# EAGLE schematic KnightOfTone (EAGLE 9.5.2)
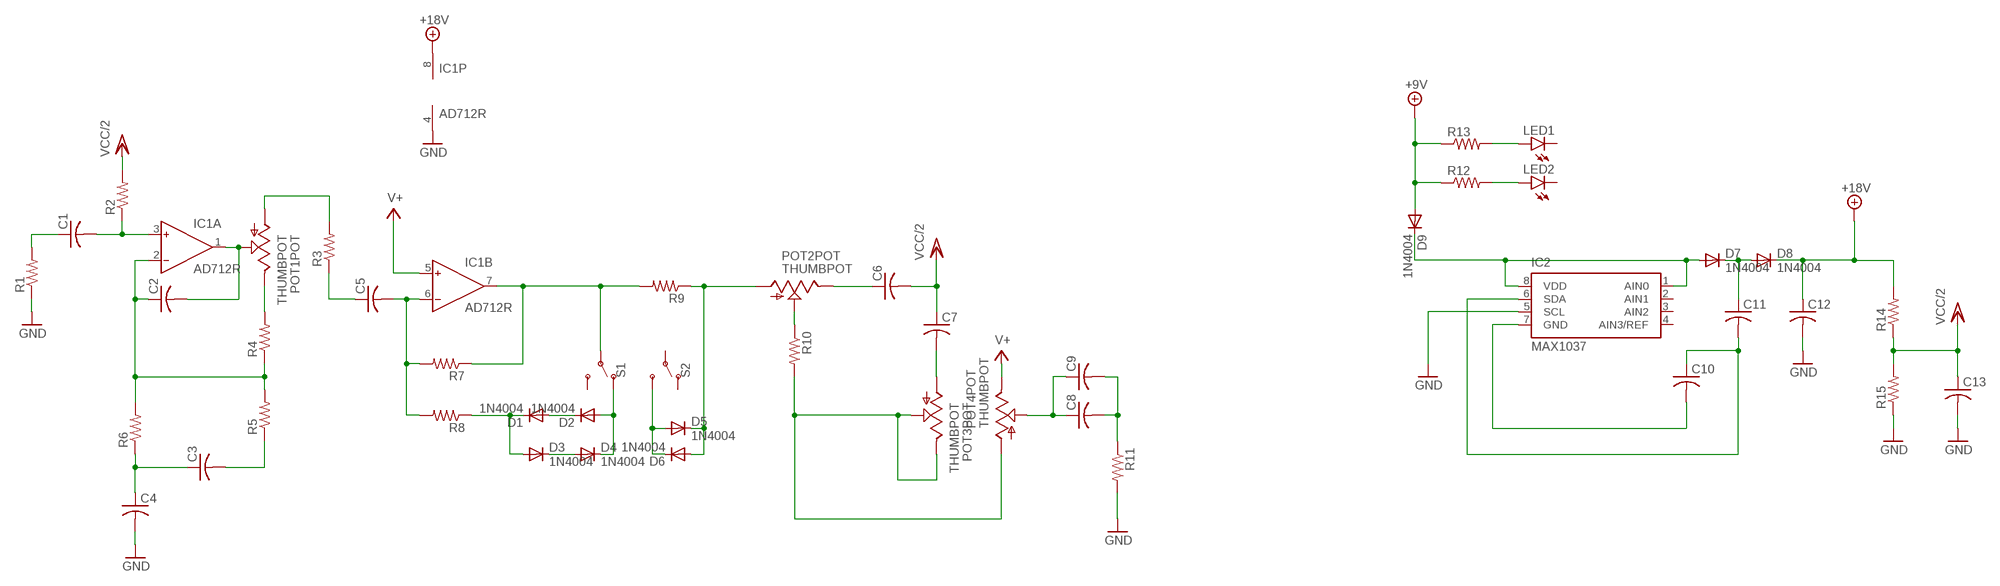
[diagram p0: schematic, sheet 1]

## Parts
C1  C-USC0603  [C0603]
C2  C-USC0603  [C0603]
C3  C-USC0603  [C0603]
C4  C-USC0603  [C0603]
C5  C-USC0603  [C0603]
C6  C-USC0603  [C0603]
C7  C-USC0603  [C0603]
C8  C-USC0603  [C0603]
C9  C-USC0603  [C0603]
C10  C-USC0603  [C0603]
C11  C-USC0603  [C0603]
C12  C-USC0603  [C0603]
C13  C-USC0603  [C0603]
D1  1N4004  [DO41-10]
D2  1N4004  [DO41-10]
D3  1N4004  [DO41-10]
D4  1N4004  [DO41-10]
D5  1N4004  [DO41-10]
D6  1N4004  [DO41-10]
D7  1N4004  [DO41-10]
D8  1N4004  [DO41-10]
D9  1N4004  [DO41-10]
IC1  AD712R  [SO8]
IC2  MAX1037  [SOT23-8L]
LED1  LED3MM  [LED3MM]
LED2  LED3MM  [LED3MM]
POT1  THUMBPOT  [THUMBWHEEL]
POT2  THUMBPOT  [THUMBWHEEL]
POT3  THUMBPOT  [THUMBWHEEL]
POT4  THUMBPOT  [THUMBWHEEL]
R1  R-US_R0603  [R0603]
R2  R-US_R0603  [R0603]
R3  R-US_R0603  [R0603]
R4  R-US_R0603  [R0603]
R5  R-US_R0603  [R0603]
R6  R-US_R0603  [R0603]
R7  R-US_R0603  [R0603]
R8  R-US_R0603  [R0603]
R9  R-US_R0603  [R0603]
R10  R-US_R0603  [R0603]
R11  R-US_R0603  [R0603]
R12  R-US_R0603  [R0603]
R13  R-US_R0603  [R0603]
R14  R-US_R0603  [R0603]
R15  R-US_R0603  [R0603]
S1  SWITCH-SPDT-PTH-11.6X4.0MM  [SWITCH_SPDT_PTH_11.6X4.0MM]
S2  SWITCH-SPDT-PTH-11.6X4.0MM  [SWITCH_SPDT_PTH_11.6X4.0MM]

## Nets
+9V: D9.A R12.1 R13.1
+18V: C12.1 D8.C IC1.8(P:V+) R14.2
GND: C4.2 C12.2 C13.2 IC1.4(P:V-) IC2.5(SCL) R1.1 R11.2 R15.1
N$1: C1.2 IC1.3(A:IN+) R2.1
N$2: C1.1 R1.2
N$3: POT1.3(POT:E) R4.2
N$4: C3.2 R5.1
N$5: C2.1 IC1.2(A:IN-) R4.1 R5.2 R6.2
N$6: C2.2 IC1.1(A:OUT) POT1.2(POT:S)
N$7: C3.1 C4.1 R6.1
N$8: POT1.1(POT:A) R3.2
N$9: C5.1 R3.1
N$10: C5.2 IC1.6(B:IN-) R7.2 R8.2
N$12: IC1.7(B:OUT) R7.1 R9.2 S1.2(P)
N$13: D1.C D3.A R8.1
N$14: D1.A D2.C
N$15: D3.C D4.A
N$16: D2.A D4.C S1.1(O)
N$17: D5.A D6.C S2.3(S)
N$18: D5.C D6.A POT2.1(POT:A) R9.1
N$19: POT2.2(POT:S) R10.1
N$20: C6.1 POT2.3(POT:E)
N$21: POT3.2(POT:S) POT3.3(POT:E) POT4.1(POT:A) R10.2
N$22: C7.2 POT3.1(POT:A)
N$24: D7.A D9.C IC2.1(AIN0) IC2.8(VDD)
N$25: C8.1 C9.1 POT4.2(POT:S)
N$26: C8.2 C9.2 R11.1
N$28: C10.2 IC2.7(GND)
N$29: C10.1 C11.2 IC2.6(SDA)
N$30: C11.1 D7.C D8.A
N$33: LED1.A R13.2
N$34: LED2.A R12.2
V+: IC1.5(B:IN+) POT4.3(POT:E)
VCC/2: C6.2 C7.1 C13.1 R2.2 R14.1 R15.2
Unconnected: IC2.2(AIN1) IC2.3(AIN2) IC2.4(AIN3/REF) LED1.K(C) LED2.K(C) POT1.SW1(SW:S) POT1.SW2(SW:P) POT2.SW1(SW:S) POT2.SW2(SW:P) POT3.SW1(SW:S) POT3.SW2(SW:P) POT4.SW1(SW:S) POT4.SW2(SW:P) S1.3(S) S2.1(O) S2.2(P)

## Library data of the parts
C1-C13 = rcl:C-US: CAPACITOR, American symbol; SPICEPREFIX: C
D1-D9 = adafruit:1N4004: DIODE General purpose 1N400x type rectifier (With bigger pads) http://www.ladyada.net/library/pcb/eaglelibrary.html
IC1 = analog-devices:AD712: Dual Precision, Low Cost, High Speed BiFET Op Amp Source: http://www.analog.com/static/imported-files/data_sheets/AD712.pdf; MF: ALTERA CORPORATION; MPN: AD712KRZ; OC_FARNELL: 1263975; OC_NEWARK: 59K4556
IC2 = maxim:MAX103*: 2.7V to 5.5V, Low-Power, 4-/12-Channel 2-Wire Serial 8-Bit ADCs Source: http://datasheets.maxim-ic.com/en/ds/MAX1036-MAX1039M.pdf; MF: MAXIM; MPN: MAX1037EKA+T; OC_FARNELL: unknown; OC_NEWARK: 68K9410
LED1 LED2 = led:LED: LED OSRAM: - CHIPLED LG R971, LG N971, LY N971, LG Q971, LY Q971, LO R971, LY R971 LH N974, LH R974 LS Q976, LO Q976, LY Q976 LO Q996 - Hyper CHIPLED LW Q18S LB Q993, LB Q99A, LB R99A - SideLED LS A670, LO A670, LY A670, LG A670, LP A670 LB A673, LV A673, LT A673, LW A673 LH A674 LY A675 LS A676, LA A676, LO A676, LY A676, LW A676 LS A679, LY A679, LG A679 - Hyper Micro SIDELED® LS Y876, LA Y876, LO Y876, LY Y876 LT Y87S - SmartLED LW L88C, LW L88S LB L89C, LB L89S, LG L890 LS L89K, LO L89K, LY L89K LS L896, LA L896, LO L896, LY L896 - TOPLED LS T670, LO T670, LY T670, LG T670, LP T670 LSG T670, LSP T670, LSY T670, LOP T670, LYG T670 LG T671, LOG T671, LSG T671 LB T673, LV T673, LT T673, LW T673 LH T674 LS T676, LA T676, LO T676, LY T676, LB T676, LH T676, LSB T676, LW T676 LB T67C, LV T67C, LT T67C, LS T67K, LO T67K, LY T67K, LW E67C LS E67B, LA E67B, LO E67B, LY E67B, LB E67C, LV E67C, LT E67C LW T67C LS T679, LY T679, LG T679 LS T770, LO T770, LY T770, LG T770, LP T770 LB T773, LV T773, LT T773, LW T773 LH T774 LS E675, LA E675, LY E675, LS T675 LS T776, LA T776, LO T776, LY T776, LB T776 LHGB T686 LT T68C, LB T68C - Hyper Mini TOPLED® LB M676 - Mini TOPLED Santana® LG M470 LS M47K, LO M47K, LY M47K Source: http://www.osram.convergy.de LUXEON: - LUMILED® LXK2-PW12-R00, LXK2-PW12-S00, LXK2-PW14-U00, LXK2-PW14-V00 LXK2-PM12-R00, LXK2-PM12-S00, LXK2-PM14-U00 LXK2-PE12-Q00, LXK2-PE12-R00, LXK2-PE12-S00, LXK2-PE14-T00, LXK2-PE14-U00 LXK2-PB12-K00, LXK2-PB12-L00, LXK2-PB12-M00, LXK2-PB14-N00, LXK2-PB14-P00, LXK2-PB14-Q00 LXK2-PR12-L00, LXK2-PR12-M00, LXK2-PR14-Q00, LXK2-PR14-R00 LXK2-PD12-Q00, LXK2-PD12-R00, LXK2-PD12-S00 LXK2-PH12-R00, LXK2-PH12-S00 LXK2-PL12-P00, LXK2-PL12-Q00, LXK2-PL12-R00 Source: www.luxeon.com KINGBRIGHT: KA-3528ASYC Source: www.kingbright.com
POT1-POT4 = adafruit:THUMBPOT: Thumbwheel pot with switch Available in horizontal (Alpha RV121SF) or vertical (Xicon 311-1701)
R1-R15 = rcl:R-US_: RESISTOR, American symbol; SPICEPREFIX: R
S1 S2 = SparkFun-Switches:SWITCH-SPDT: Single Pole, Double Throw (SPDT) Switch Single-pole, double-throw (SPDT) switch. Variant Overview SMD-AYZ0202 Surface Mount DPDT Switch <https://www.sparkfun.com/products/597> (COM-00597) Used on e.g. LilyPad Arduino USB - ATmega32U4 Board <https://www.sparkfun.com/products/12049> PTH-11.6X4.0MM SPDT Mini Power Switch <https://www.sparkfun.com/products/102> (COM-00102) Used on e.g. SparkFun Simon Says - Through-Hole Soldering Kit <https://www.sparkfun.com/products/10547> (KIT-10547) PTH-11.6X4.0MM-KIT KIT version of SPDT Mini Power Switch - Simplifies soldering by removing tStop of switch pins - only one side can be soldered. PTH-11.6X4.0MM-LOCK LOCK version of SPDT Mini Power Switch - Offset pins hold switch in place for easier soldering. SMD-RIGHT-ANGLE Surface Mount Right Angle Switch <https://www.sparkfun.com/products/10860> (COM-10860) Used on e.g. SparkFun ESP8266 Thing <https://www.sparkfun.com/products/13231>; PROD_ID: SWCH-08261; SF_SKU: COM-00102